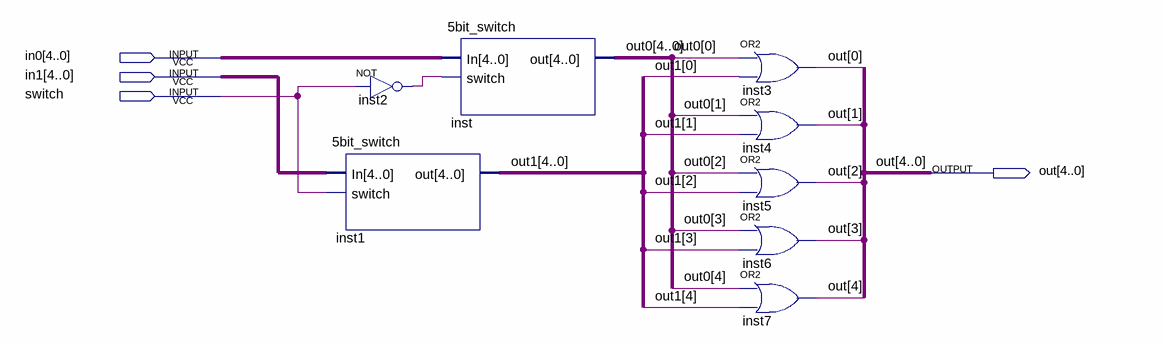
[diagram p0: schematic sheet]
// Quartus schematic 5bit_multiplexor.bdf as structural Verilog: 8 symbols, 4 pins
module \5bit_multiplexor  (
  input  [4:0] in0,
  input  [4:0] in1,
  input  switch,
  output [4:0] out
);

  wire inst2_out;
  wire [4:0] out0, out1;

  \5bit_switch  inst1 (.In(in1), .switch(switch), .out(out1));
  not inst2 (inst2_out, switch);
  \5bit_switch  inst (.In(in0), .switch(inst2_out), .out(out0));
  or inst3 (out[0], out0[0], out1[0]);
  or inst4 (out[1], out0[1], out1[1]);
  or inst5 (out[2], out0[2], out1[2]);
  or inst6 (out[3], out0[3], out1[3]);
  or inst7 (out[4], out0[4], out1[4]);
endmodule
